# Altium schematic sheet 1_V2.schdoc
size 708 x 330 mm; Name: A_A3; Symbol: A_A3; Device: A_A3; @Project Name: samrtclick; REV: 1.0; Date: 2023-02-28; Sheet: 1/1; Draw By: kano; Company: Your Company; Convert to PCB: yes; Add into BOM: yes; @Page No: 1; @Page Count: 1; @Schematic Name: V2; @Update Date: 2023-04-04; @Page Name: V2
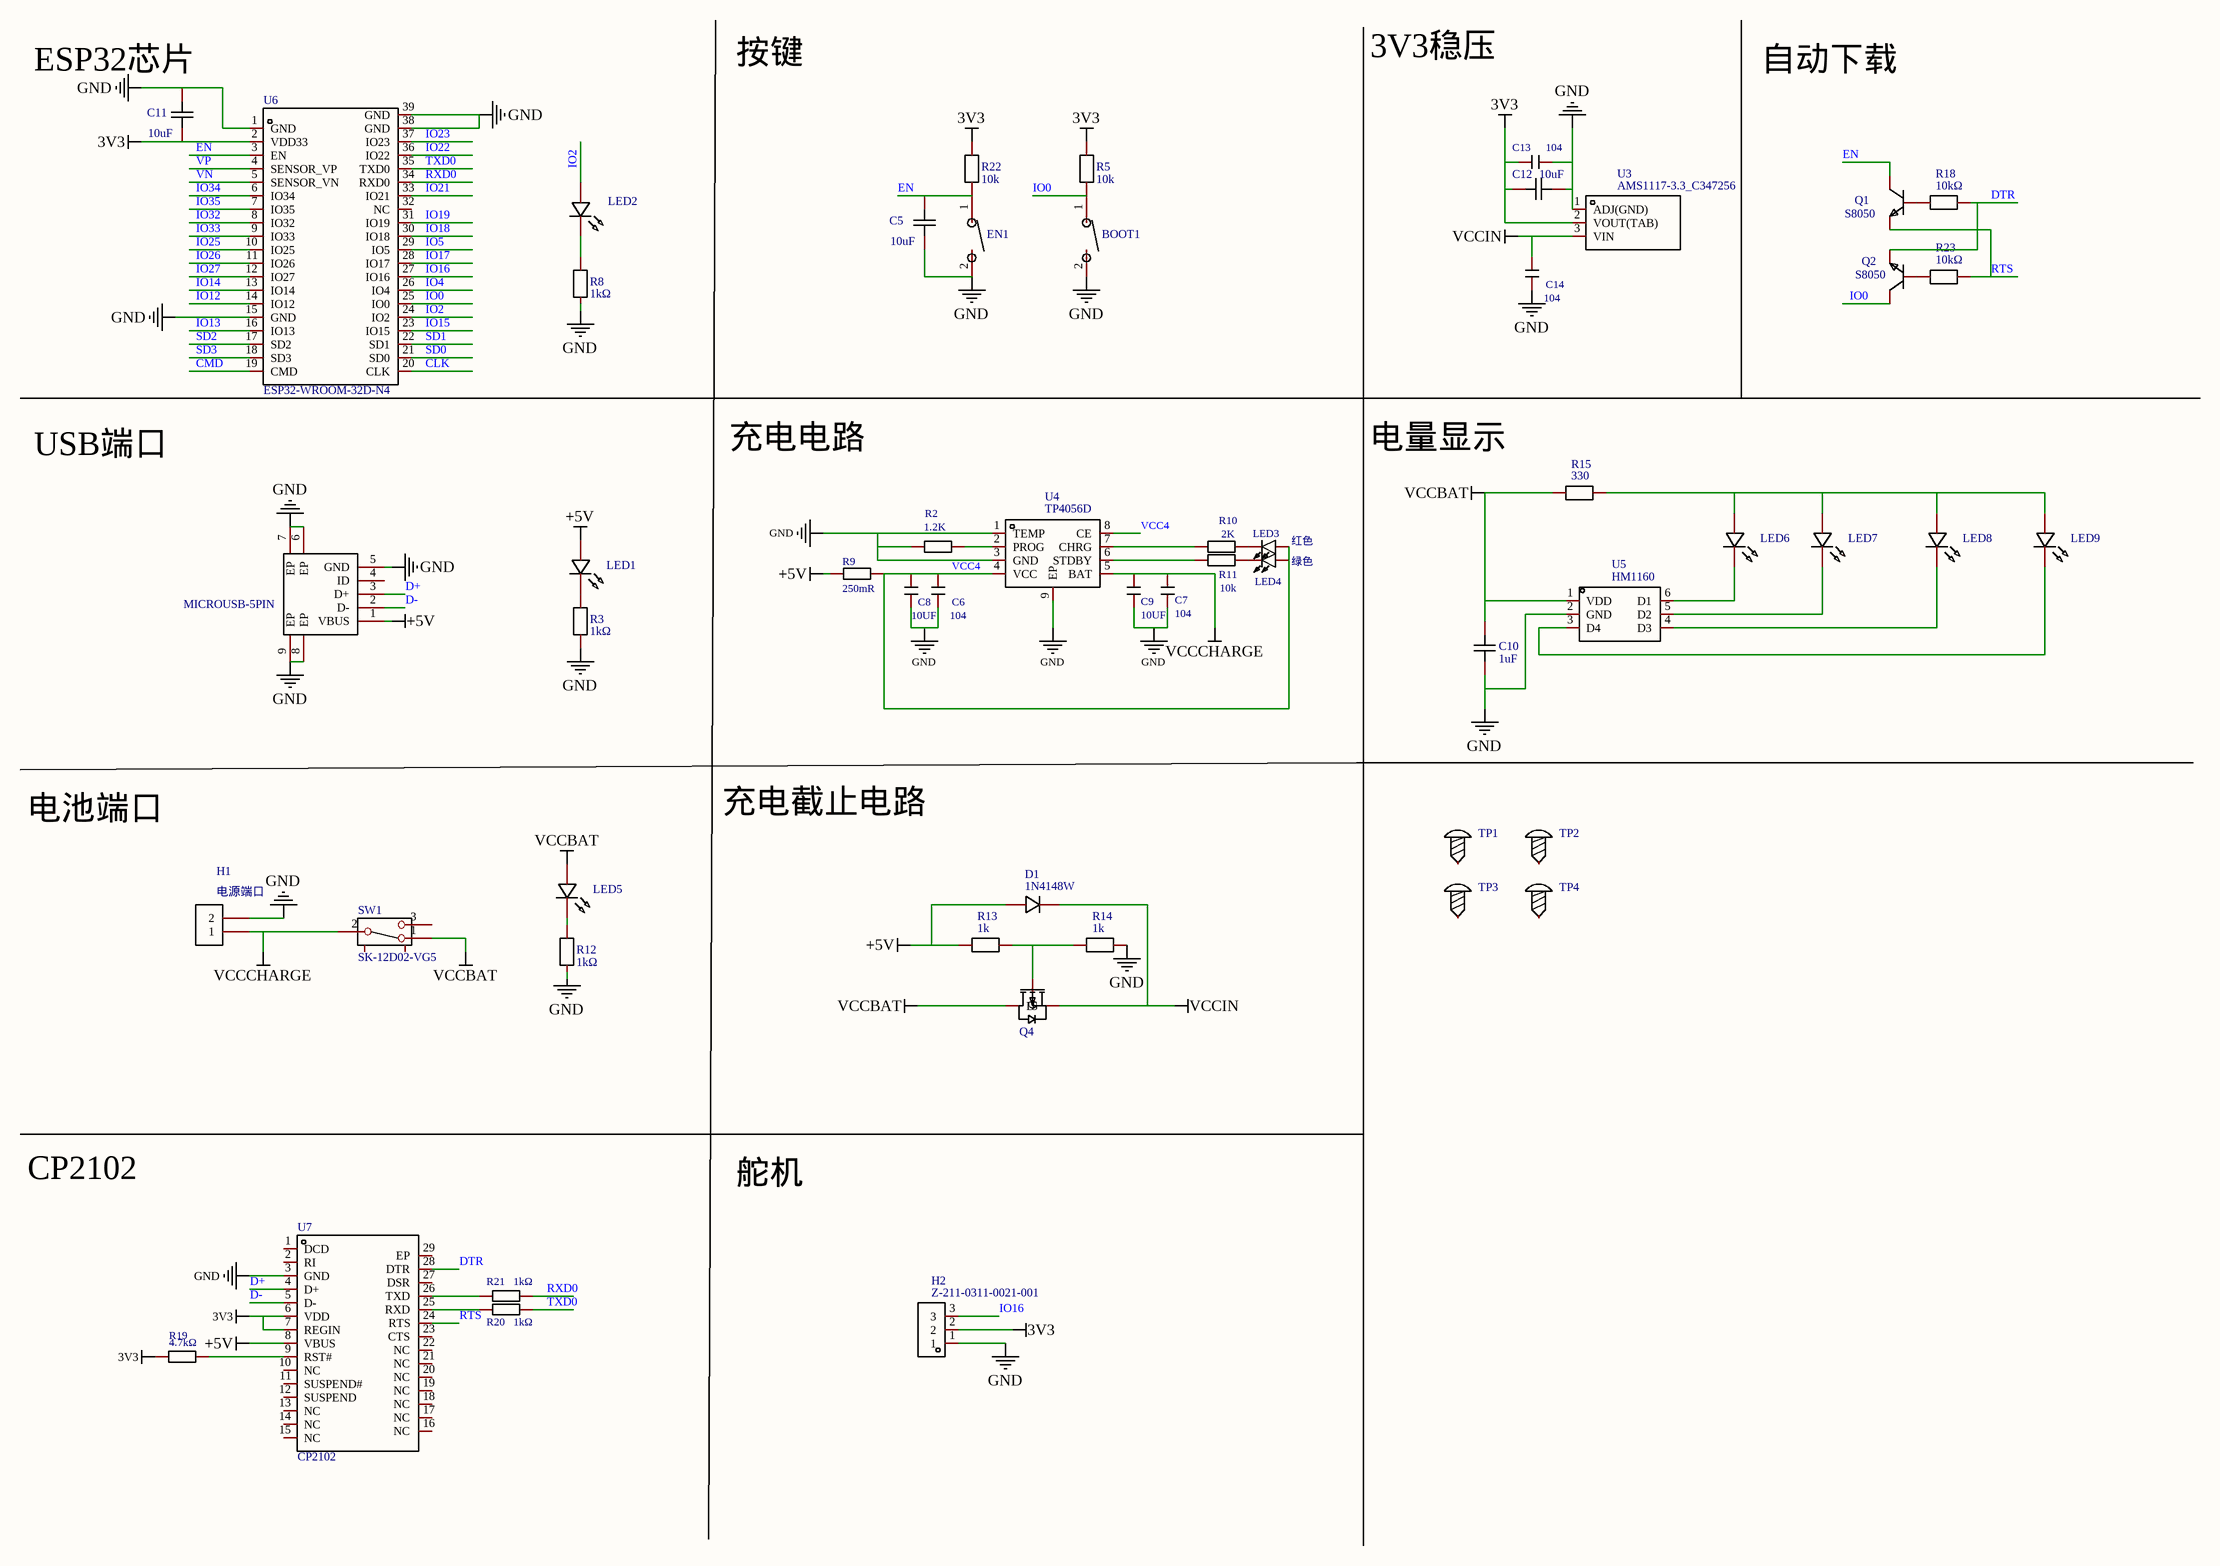
[diagram p0: 1_V2.schdoc]

## Parts
BOOT1  TSA343G00-250J2  [SW-SMD_L4.0-W2.9-LS5.0]  (value not drawn)
C5  10uF  [C0603]
C6  104  [C0603]
C7  104  [C0603]
C8  10UF  [C0805]
C9  10UF  [C0805]
C10  1uF  [C0805]
C11  10uF  [C0603]
C12  10uF  [C0805]
C13  104  [C0603]
C14  104  [C0603]
D1  1N4148W  [SOD-123FL_L2.6-W1.6-LS3.4-RD]
EN1  TSA343G00-250J2  [SW-SMD_L4.0-W2.9-LS5.0]  (value not drawn)
H1  电源端口  [HDR-TH_2P-P2.54-V-M-1]
H2  Z-211-0311-0021-001  [HDR-TH_3P-P2.54-V-M-1]
LED1  LED-0603_R  [LED0603_RED]  (value not drawn)
LED2  VLMTG1401-GS08  [LED0603-RD_GREEN]  (value not drawn)
LED3  红色  [L0603-RD]
LED4  绿色  [L0603-RD]
LED5  LED-0603_R  [LED0603_RED]  (value not drawn)
LED6  LED-0603_R  [LED0603_RED]  (value not drawn)
LED7  LED-0603_R  [LED0603_RED]  (value not drawn)
LED8  LED-0603_R  [LED0603_RED]  (value not drawn)
LED9  LED-0603_R  [LED0603_RED]  (value not drawn)
NO1  MICROUSB-5PIN  [USB-SMD_5P_MICROUSB-5PIN]
Q1  S8050  [SOT-23-3_L2.9-W1.3-P1.90-LS2.4-BR]
Q2  S8050  [SOT-23-3_L2.9-W1.3-P1.90-LS2.4-BR]
Q4  AO3401A_P  [AO3401A_SOT-23-3]  (value not drawn)
R2  1.2K  [R0603]
R3  1kΩ  [R0603]
R5  10k  [R0603]
R8  1kΩ  [R0603]
R9  250mR  [R1206_1]
R10  2K  [R0603]
R11  10k  [R0603]
R12  1kΩ  [R0603]
R13  1k  [R0603]
R14  1k  [R0603]
R15  330  [R0603]
R18  10kΩ  [R0603]
R19  4.7kΩ  [R0603]
R20  1kΩ  [R0603]
R21  1kΩ  [R0603]
R22  10k  [R0603]
R23  10kΩ  [R0603]
SW1  SK-12D02-VG5  [SW-TH_SK-12D02-VG5]
TP1  M2螺丝  [M2螺丝]  (value not drawn)
TP2  M2螺丝  [M2螺丝]  (value not drawn)
TP3  M2螺丝  [M2螺丝]  (value not drawn)
TP4  M2螺丝  [M2螺丝]  (value not drawn)
U3  AMS1117-3.3_C347256  [SOT-223-4_L6.5-W3.5-P2.30-LS7.0-BR]
U4  TP4056D  [ESOP-8_L4.9-W3.9-P1.27-LS6.0-TL-EP]
U5  HM1160  [SOT23-6]
U6  ESP32-WROOM-32D-N4  [WIFIM-SMD_39P-L25.5-W18.0-P1.27-BL]
U7  CP2102  [QFN-28_L5.0-W5.0-P0.50-TL-EP3.2]

## Nets
3V3: C11.1 C12.1 C13.2 H2.2 R5.2 R19.1 R22.2 U3.2(VOUT(TAB)) U6.2(VDD33) U7.6(VDD) U7.7(REGIN)
+5V: D1.2 LED1.1 NO1.1(VBUS) R9.1 R13.1 U7.8(VBUS)
GND: BOOT1.2 C5.1 C6.1 C7.1 C8.1 C9.1 C10.1 C11.2 C12.2 C13.1 C14.1 EN1.2 H1.2 H2.1 NO1.5(GND) NO1.6(EP) NO1.7(EP) NO1.8(EP) NO1.9(EP) R2.1 R3.2 R8.2 R12.2 R14.2 U3.1(ADJ(GND)) U4.1(TEMP) U4.3(GND) U4.9(EP) U5.2(GND) U6.1(GND) U6.15(GND) U6.38(GND) U6.39(GND) U7.3(GND)
VCCBAT: C10.2 LED5.1 Q4.3(D) R15.1 SW1.1 U5.1(VDD)
VCCCHARGE: C7.2 C9.2 H1.1 SW1.2 U4.5(BAT)
VCCIN: C14.2 D1.1 Q4.2(S) U3.3(VIN)
CLK: U6.20(CLK)
CMD: U6.19(CMD)
D+: NO1.3(D+) U7.4(D+)
D-: NO1.2(D-) U7.5(D-)
DTR: Q2.2(E) R18.2 U7.28(DTR)
EN: C5.2 EN1.1 Q1.3(C) R22.1 U6.3(EN)
IO0: BOOT1.1 Q2.3(C) R5.1 U6.25(IO0)
IO2: LED2.1 U6.24(IO2)
IO4: U6.26(IO4)
IO5: U6.29(IO5)
IO12: U6.14(IO12)
IO13: U6.16(IO13)
IO14: U6.13(IO14)
IO15: U6.23(IO15)
IO16: H2.3 U6.27(IO16)
IO17: U6.28(IO17)
IO18: U6.30(IO18)
IO19: U6.31(IO19)
IO21: U6.33(IO21)
IO22: U6.36(IO22)
IO23: U6.37(IO23)
IO25: U6.10(IO25)
IO26: U6.11(IO26)
IO27: U6.12(IO27)
IO32: U6.8(IO32)
IO33: U6.9(IO33)
IO34: U6.6(IO34)
IO35: U6.7(IO35)
RTS: Q1.2(E) R23.2 U7.24(RTS)
RXD0: R21.2 U6.34(RXD0)
SD0: U6.21(SD0)
SD1: U6.22(SD1)
SD2: U6.17(SD2)
SD3: U6.18(SD3)
TXD0: R20.2 U6.35(TXD0)
VCC4: C6.2 C8.2 LED3.1(A) LED4.1(A) R9.2 U4.4(VCC) U4.8(CE)
VN: U6.5(SENSOR_VN)
VP: U6.4(SENSOR_VP)
NetLED1_2: LED1.2 R3.1
NetLED2_2: LED2.2 R8.1
NetLED3_2: LED3.2(K) R10.2
NetLED4_2: LED4.2(K) R11.2
NetLED5_2: LED5.2 R12.1
NetLED6_1: LED6.1 LED7.1 LED8.1 LED9.1 R15.2
NetLED6_2: LED6.2 U5.6(D1)
NetLED7_2: LED7.2 U5.5(D2)
NetLED8_2: LED8.2 U5.4(D3)
NetLED9_2: LED9.2 U5.3(D4)
NetQ1_1: Q1.1(B) R18.1
NetQ2_1: Q2.1(B) R23.1
NetQ4_1: Q4.1(G) R13.2 R14.1
NetR2_2: R2.2 U4.2(PROG)
NetR10_1: R10.1 U4.7(CHRG)
NetR11_1: R11.1 U4.6(STDBY)
NetR19_2: R19.2 U7.9(RST#)
NetR20_1: R20.1 U7.25(RXD)
NetR21_1: R21.1 U7.26(TXD)

Not connected (* = marked no-connect by the designer): NO1 4(ID); SW1 3 4 5; TP1 1; TP2 1; TP3 1; TP4 1; U6 32(NC); U7 1(DCD) 2(RI) 10(NC) 11(SUSPEND#) 12(SUSPEND) 13(NC) 14(NC) 15(NC) 16(NC) 17(NC) 18(NC) 19(NC) 20(NC) 21(NC) 22(NC) 23(CTS) 27(DSR) 29(EP)

## Notes on the sheet
- 3V3稳压
- (near C11) ESP32芯片
- 按键
- 自动下载
- USB端口
- 充电电路
- 电量显示
- 电池端口
- 充电截止电路
- CP2102
- 舵机
- 1
- 2
- 3
- 4
- 5
- 6
- 7
- 8
- A
- B
- C
- D
- E
- TITLE:
- samrtclick
- REV:
- 1.0
- Date:
- Company:
- 2023-02-28
- Your Company
- Drawn By:
- kano
- Sheet:
- 1/1
- V2
- 2023-04-04

## Library data of the parts
BOOT1 EN1 = TSA343G00-250J2: 触点电流:50mA;额定电压(DC):12V;绝缘电阻:100MΩ;电路结构:单刀单掷;安装方式:立贴;按钮形状:圆形按钮;按钮/盖帽颜色:黑色;带灯:无;作用力:250gf@±50gf;机械寿命:50000;工作温度:-25℃~+70℃;引脚样式:SMD接片;开关长度:3.95mm;开关宽度:2.9mm;开关高度:2mm;带支架:否;; Manufacturer: BRIGHT(博瑞泰); Add into BOM: yes; Contact Current: 50mA; Voltage Rating (DC): 12V; Insulation Resistance: 100MΩ; Circuit: 单刀单掷; Actuator Style: 圆形按钮; Actuator/Cap Color: 黑色; With Lamp: 无; Mechanical Life: 50000; Pin Style: SMD接片; Switch Length: 3.95mm; Switch Width: 2.9mm; Switch Height: 2mm; Strike Gundam: 否; Actuator Orientation: 顶部触动; 3DModel: SW-SMD_L4.0-W2.9-H2-P4.15-EH; Paste Type: expand; Origin Footprint: SW-SMD_L4.0-W2.9-P4.15-EH; Name: TSA343G00-250J2; Symbol: TSA343G00-250J2; Device: TSA343G00-250J2; LCSC Part Name: 3*4 两脚小龟不带柱  250gf; Supplier Part: C354946; Manufacturer Part: TSA343G00-250J2; Supplier Footprint: SMD; JLCPCB Part Class: Extended Part; Datasheet: https://atta.szlcsc.com/upload/public/pdf/source/20190426/C354946_6B70DFBDFA823D17B8EB46FB9599F693.pdf; Supplier: LCSC; Convert to PCB: yes; Mounting Style: 立贴; Operating Force: 250gf@±50gf; Operating Temperature: -25℃~+70℃; Illumination Color: -; link: https://item.szlcsc.com/457634.html; Assembly Type: smtWeld
C5 C11 = 10uF: 3DModel: C0603_L1.6-W0.8-H0.8; Add into BOM: yes; Name: 10uF; Symbol: 10uF; Device: 10uF; link: https://item.szlcsc.com/362304.html; Convert to PCB: yes; Origin Footprint: C0603
C6 C7 C13 C14 = 104: 3DModel: C0603_L1.6-W0.8-H0.8; BOM名称: 无极性贴片电容; 版权归属: 源创客; Add into BOM: yes; Name: 104; Symbol: 104; Device: 104; link: https://item.szlcsc.com/362304.html; 学习资源: www.ooocke.com; Convert to PCB: yes; Origin Footprint: C0603
C8 C9 = 10UF: 3DModel: C0805_L2.0-W1.3-H1.3; BOM名称: 无极性贴片电容; 版权归属: 源创客; Add into BOM: yes; Name: 10UF; Symbol: 10UF; Device: 10UF; link: https://item.szlcsc.com/373011.html; 学习资源: www.ooocke.com; Convert to PCB: yes; Origin Footprint: C0805
C10 = 1uF: 3DModel: C0805_L2.0-W1.3-H1.3; Add into BOM: yes; Name: 1uF; Symbol: 1uF; Device: 1uF; link: https://item.szlcsc.com/373011.html; Convert to PCB: yes; Origin Footprint: C0805
C12 = 10uF: 3DModel: C0805_L2.0-W1.3-H1.3; Add into BOM: yes; Name: 10uF; Symbol: 10uF; Device: 10uF; link: https://item.szlcsc.com/373011.html; Convert to PCB: yes; Origin Footprint: C0805
D1 = 1N4148W: Manufacturer: Tak Cheong; 3DModel: SOD-123FL_L2.8-W1.8-H1.1-LS3.6; Add into BOM: yes; Name: 1N4148W; Symbol: 1N4148W; Device: 1N4148W; link: https://atta.szlcsc.com/upload/public/pdf/source/20181106/C323857_0FA3C8BFA639C8DE43C1526AE6096176.pdf; Supplier: LCSC; Manufacturer Part: 1N4148W; Supplier Part: C129216; Convert to PCB: yes; Origin Footprint: SOD-123FL_L2.6-W1.6-LS3.4-RD
H1 = 电源端口: Manufacturer: TE Connectivity(美国泰科); Manufacturer Part: 3-644456-2; 3DModel: HDR-M-2.54_1x2; Add into BOM: yes; Name: 电源端口; Symbol: 电源端口; Device: 电源端口; link: https://item.szlcsc.com/366904.html; Supplier: LCSC; Supplier Part: C90288; JLCPCB Part Class: Extended Part; Convert to PCB: yes; Origin Footprint: HDR-TH_2P-P2.54-V-M-1
H2 = Z-211-0311-0021-001: Manufacturer: Nextron(正凌); 3DModel: HDR-M-2.54_1x3; Add into BOM: yes; Name: Z-211-0311-0021-001; Symbol: Z-211-0311-0021-001; Device: Z-211-0311-0021-001; link: https://item.szlcsc.com/50265.html; Supplier: LCSC; Manufacturer Part: Z-211-0311-0021-001; Supplier Part: C152153; JLCPCB Part Class: Extended Part; Convert to PCB: yes; Origin Footprint: HDR-TH_3P-P2.54-V-M-1
LED1 LED5-LED9 = LED-0603_R: Manufacturer: EVERLIGHT(台湾亿光); Manufacturer Part: 19-217/R6C-AL1M2VY/3T; Add into BOM: yes; Name: LED-0603_R; Symbol: LED-0603_R; Device: LED-0603_R; 3DModel: LED0603_Red; Supplier Part: C72044; Supplier: LCSC; Convert to PCB: yes; Origin Footprint: LED0603_RED
LED2 = VLMTG1401-GS08: 照明颜色:-;色温 - CCT（K）:-;主波长/色坐标:-;正向电压（Vf）:-;; Manufacturer: VISHAY(威世); Add into BOM: yes; 3DModel: LED0603_Red; Name: VLMTG1401-GS08; Symbol: VLMTG1401-GS08; Device: VLMTG1401-GS08; LCSC Part Name: VLMTG1401-GS08; Supplier Part: C511604; Manufacturer Part: VLMTG1401-GS08; Supplier Footprint: 0603; JLCPCB Part Class: Extended Part; Datasheet: https://atta.szlcsc.com/upload/public/pdf/source/20200413/C511604_272E80EA2E53340B96FA7453D68B4387.pdf; Supplier: LCSC; Convert to PCB: yes; Mounting Type: -; Illumination Color: -; Lens Color: -; Correlated Color Temperature - CCT(K): -; Luminous Intensity (IF=20mA): -; Luminous Flux/Radiant Flux: -; Color Rendering Index(CRI): -; Dominant Wavelength / Coordinate rank: -; Vf - Forward Voltage: -; Size / Dimension: -; Operating Temperature: -; Height (Max): -; Origin Footprint: LED0603_RED
LED3 = 红色: BOM名称: 贴片LED; 版权归属: 源创客; Add into BOM: yes; Name: 红色; Symbol: 红色; Device: 红色; link: https://atta.szlcsc.com/upload/public/pdf/source/20180326/C98007_E988380F54303ED5DB1EDD3A08ED9857.pdf; 3DModel: L0603-RD; 学习资源: www.ooocke.com; Convert to PCB: yes; Origin Footprint: L0603-RD
LED4 = 绿色: BOM名称: 贴片LED; 版权归属: 源创客; Add into BOM: yes; Name: 绿色; Symbol: 绿色; Device: 绿色; link: https://atta.szlcsc.com/upload/public/pdf/source/20180326/C98007_E988380F54303ED5DB1EDD3A08ED9857.pdf; 3DModel: L0603-RD; 学习资源: www.ooocke.com; Convert to PCB: yes; Origin Footprint: L0603-RD
NO1 = MICROUSB-5PIN: Add into BOM: yes; Name: MICROUSB-5PIN; Symbol: MICROUSB-5PIN; Device: MICROUSB-5PIN; link: https://wenku.baidu.com/view/86fe0d6b3968011ca200912d.html; 3DModel: USB-SMD_5P_MICROUSB-5PIN; Supplier: LCSC; Supplier Part: C9900001196; Manufacturer Part: MicroUSB-5PIN; JLCPCB Part Class: Extended Part; Convert to PCB: yes; Origin Footprint: USB-SMD_5P_MICROUSB-5PIN; NO_CONNECT: yes
Q1 Q2 = S8050: Manufacturer: WPMtek(维攀微); 3DModel: SOT-23-3P_L2.9-W1.3-H1.0-LS2.4-P0.95; Add into BOM: yes; Name: S8050; Symbol: S8050; Device: S8050; link: https://www.diodes.com/assets/Package-Files/SOT23.pdf; Supplier: LCSC; Supplier Part: C2688231; Manufacturer Part: S8050; Convert to PCB: yes; Origin Footprint: SOT-23-3_L2.9-W1.3-P1.90-LS2.4-BR
Q4 = AO3401A_P: Symbol: P_MOS; Add into BOM: yes; Device: AO3401A_P; Supplier Footprint: SOT-23-3L; Convert to PCB: yes; Supplier Part: C15127
R2 = 1K: BOM名称: 贴片电阻; 版权归属: 源创客; Add into BOM: yes; Name: 1.2K; Symbol: 1K; Device: 1K; 3DModel: R0603; link: https://www.mouser.in/datasheet/2/447/PYu_RT_1_to_0_01_RoHS_L_11-1669912.pdf; 学习资源: www.ooocke.com; Convert to PCB: yes; Origin Footprint: R0603
R3 R8 R12 = ERA3VEB1001V: 温度系数:±25ppm/K;温度系数:±25ppm/K;工作温度范围:-55℃~+155℃;工作温度范围:-55℃~+155℃;精度:±0.1%;最大工作电压:100V;类型:薄膜电阻;功率:125mW;阻值:1kΩ;; Manufacturer: PANASONIC(松下); Add into BOM: yes; Tolerance: ±0.1%; Overload Voltage (Max): 100V; Power(Watts): 125mW; 3DModel: R0603_L1.6-W0.8-H0.8; Name: 1kΩ; Symbol: ERA3VEB1001V; Device: ERA3VEB1001V; LCSC Part Name: 1KΩ(1001) ±0.1%; Supplier Part: C490794; Manufacturer Part: ERA3VEB1001V; Supplier Footprint: 0603; JLCPCB Part Class: Extended Part; Datasheet: https://atta.szlcsc.com/upload/public/pdf/source/20200407/C490794_144E786BD6B5906C11E86C00580B1EF5.pdf; Supplier: LCSC; Convert to PCB: yes; Temperature Coefficient: ±25ppm/K; Operating Temperature Range: -55℃~+155℃; Type: 薄膜电阻; Value: 1kΩ; link: https://item.szlcsc.com/137208.html; Origin Footprint: R0603
R5 R22 = 10k: 3DModel: R0603_L1.6-W0.8-H0.8; Add into BOM: yes; Name: 10k; Symbol: 10k; Device: 10k; link: https://item.szlcsc.com/137208.html; Convert to PCB: yes; Origin Footprint: R0603
R9 = 250mR: BOM名称: 贴片电阻; 版权归属: 源创客; Add into BOM: yes; Name: 250mR; Symbol: 250mR; Device: 250mR; link: https://item.szlcsc.com/311874.html; 学习资源: www.ooocke.com; Convert to PCB: yes; Origin Footprint: R1206_1
R10 = 2K: BOM名称: 贴片电阻; 版权归属: 源创客; Add into BOM: yes; Name: 2K; Symbol: 2K; Device: 2K; 3DModel: R0603; link: https://www.mouser.in/datasheet/2/447/PYu_RT_1_to_0_01_RoHS_L_11-1669912.pdf; 学习资源: www.ooocke.com; Convert to PCB: yes; Origin Footprint: R0603
R11 = 10k: BOM名称: 贴片电阻; 版权归属: 源创客; Add into BOM: yes; Name: 10k; Symbol: 10k; Device: 10k; 3DModel: R0603; link: https://www.mouser.in/datasheet/2/447/PYu_RT_1_to_0_01_RoHS_L_11-1669912.pdf; 学习资源: www.ooocke.com; Convert to PCB: yes; Origin Footprint: R0603
R13 R14 = 1k: Add into BOM: yes; Name: 1k; Symbol: 1k; Device: 1k; 3DModel: R0603; link: https://www.mouser.in/datasheet/2/447/PYu_RT_1_to_0_01_RoHS_L_11-1669912.pdf; Convert to PCB: yes; Origin Footprint: R0603
R15 = 330: Add into BOM: yes; Name: 330; Symbol: 330; Device: 330; 3DModel: R0603; link: https://www.mouser.in/datasheet/2/447/PYu_RT_1_to_0_01_RoHS_L_11-1669912.pdf; Convert to PCB: yes; Origin Footprint: R0603
R18 R23 = ERJPB3B1002V: 电阻类型:厚膜电阻;阻值:10kΩ;精度:±0.1%;功率:200mW;温度系数:±50ppm/℃;最大工作电压:200V;工作温度范围:-55℃~+155℃;; Manufacturer: PANASONIC(松下); Add into BOM: yes; Tolerance: ±0.1%; Power(Watts): 200mW; Overload Voltage (Max): 200V; 3DModel: R0603_L1.6-W0.8-H0.8; Name: 10kΩ; Symbol: ERJPB3B1002V; Device: ERJPB3B1002V; LCSC Part Name: 10kΩ ±0.1% 200mW; Supplier Part: C161787; Manufacturer Part: ERJPB3B1002V; Supplier Footprint: 0603; JLCPCB Part Class: Extended Part; Datasheet: https://atta.szlcsc.com/upload/public/pdf/source/20180125/C161787_15168649453061302830.pdf; Supplier: LCSC; Convert to PCB: yes; Type: 厚膜电阻; Value: 10kΩ; Temperature Coefficient: ±50ppm/℃; Operating Temperature Range: -55℃~+155℃; link: https://item.szlcsc.com/137208.html; Origin Footprint: R0603
R19 = TNPW06034K70BEEA: 电阻类型:薄膜电阻;阻值:4.7kΩ;精度:±0.1%;功率:125mW;; Manufacturer: VISHAY(威世); Add into BOM: yes; Tolerance: ±0.1%; Power(Watts): 125mW; Temperature Coefficient: ±25ppm/℃; BOM名称: 贴片电阻; 版权归属: 源创客; Name: 4.7kΩ; Symbol: TNPW06034K70BEEA; Device: TNPW06034K70BEEA; LCSC Part Name: 4.7kΩ ±0.1% 125mW; Supplier Part: C844460; Manufacturer Part: TNPW06034K70BEEA; Supplier Footprint: 0603; JLCPCB Part Class: Extended Part; Datasheet: https://atta.szlcsc.com/upload/public/pdf/source/20221018/D2582224CA146715145C4BCCF2530B6B.pdf; Supplier: LCSC; Convert to PCB: yes; Type: 薄膜电阻; Value: 4.7kΩ; Operating Temperature Range: -55℃~+155℃; 3DModel: R0603; link: https://www.mouser.in/datasheet/2/447/PYu_RT_1_to_0_01_RoHS_L_11-1669912.pdf; Origin Footprint: R0603; 学习资源: www.ooocke.com
R20 R21 = ERA3VEB1001V: 温度系数:±25ppm/K;温度系数:±25ppm/K;工作温度范围:-55℃~+155℃;工作温度范围:-55℃~+155℃;精度:±0.1%;最大工作电压:100V;类型:薄膜电阻;功率:125mW;阻值:1kΩ;; Manufacturer: PANASONIC(松下); Add into BOM: yes; Tolerance: ±0.1%; Overload Voltage (Max): 100V; Power(Watts): 125mW; BOM名称: 贴片电阻; 版权归属: 源创客; Name: 1kΩ; Symbol: ERA3VEB1001V; Device: ERA3VEB1001V; LCSC Part Name: 1KΩ(1001) ±0.1%; Supplier Part: C490794; Manufacturer Part: ERA3VEB1001V; Supplier Footprint: 0603; JLCPCB Part Class: Extended Part; Datasheet: https://atta.szlcsc.com/upload/public/pdf/source/20200407/C490794_144E786BD6B5906C11E86C00580B1EF5.pdf; Supplier: LCSC; Convert to PCB: yes; Temperature Coefficient: ±25ppm/K; Operating Temperature Range: -55℃~+155℃; Type: 薄膜电阻; Value: 1kΩ; 3DModel: R0603; link: https://www.mouser.in/datasheet/2/447/PYu_RT_1_to_0_01_RoHS_L_11-1669912.pdf; Origin Footprint: R0603; 学习资源: www.ooocke.com
SW1 = SK-12D02-VG5_C136722: 额定电流(DC):-;额定电压(DC):-;额定电流(AC):-;额定电压(AC):-;电路结构:单刀双掷;安装方式:卧插;机械寿命:5000;滑钮形状:矩形柱状;引脚样式:PC引脚;工作温度:-25℃~+70℃;开关高度:9.5mm;; Manufacturer: 韩国韩荣; Add into BOM: yes; Circuit: 单刀双掷; Mechanical Life: 5000; Actuator Style: 矩形柱状; Pin Style: PC引脚; Switch Height: 9.5mm; Name: SK-12D02-VG5; Symbol: SK-12D02-VG5; Device: SK-12D02-VG5_C136722; LCSC Part Name: SK-12D02-VG5; Supplier Part: C136722; Manufacturer Part: SK-12D02-VG5; Supplier Footprint: 插件; JLCPCB Part Class: Extended Part; Datasheet: https://atta.szlcsc.com/upload/public/pdf/source/20180731/C136723_39114FC09BF2E9DC98823B78B7234B45.pdf; Supplier: LCSC; Convert to PCB: yes; Current Rating (DC): -; Voltage Rating (DC): -; Current Rating (AC): -; Voltage Rating (AC): -; Mounting Style: 卧插; Operating Temperature: -25℃~+70℃; NO_CONNECT: yes
TP1-TP4 = M2螺丝: Symbol: 螺丝孔; Convert to PCB: yes; Device: M2螺丝; Add into BOM: yes; Supplier Footprint: 插件
U3 = AMS1117-3.3_C347256: Manufacturer: Youtai Semiconductor Co., Ltd.; 3DModel: SOT-223-4P_L6.5-W3.5-H1.6-LS7.0-P2.30; Paste Type: expand; Add into BOM: yes; Name: AMS1117-3.3_C347256; Symbol: AMS1117-3.3_C347256; Device: AMS1117-3.3_C347256; link: https://item.szlcsc.com/84517.html; Supplier: LCSC; Supplier Part: C347256; Manufacturer Part: AMS1117-3.3; Assembly Type: smtWeld; Convert to PCB: yes; Origin Footprint: SOT-223-4_L6.5-W3.5-P2.30-LS7.0-BR
U4 = TP4056D: Manufacturer: 拓微集成; 3DModel: ESOP-8_L4.9-W3.9-H1.6-LS6.0-P1.27; Add into BOM: yes; Name: TP4056D; Symbol: TP4056D; Device: TP4056D; link: https://img.jlc.com/pdf/applyPasteComponent/2022-01-14/296412A/fe074eb14c014e62a4772fc0c12ab405/TP4056D.pdf; Supplier: LCSC; Supplier Part: C9900006240; Manufacturer Part: TP4056D; JLCPCB Part Class: Extended Part; Convert to PCB: yes; Origin Footprint: ESOP-8_L4.9-W3.9-P1.27-LS6.0-TL-EP
U5 = HM1160: Manufacturer: Shenzhen Chip Hope Micro-Electronics; Manufacturer Part: LP3772-1; Add into BOM: yes; Name: HM1160; Symbol: HM1160; Device: HM1160; Supplier: LCSC; Supplier Part: C360132; Convert to PCB: yes; Origin Footprint: SOT23-6
U6 = ESP32-WROOM-32D-N4_C473012: ESP32-WROOM-32D 集成 ESP32-D0WD，功能强大，用途广泛，可以用于低功耗传感器网络和要求极高的任务，例如语音编码、音频流和 MP3 解码等。; Manufacturer: ESPRESSIF(乐鑫); Add into BOM: yes; Name: ESP32-WROOM-32D-N4; Symbol: ESP32-WROOM-32D; Device: ESP32-WROOM-32D-N4_C473012; LCSC Part Name: ESP32-WROOM-32D-N4; Supplier Part: C473012; Manufacturer Part: ESP32-WROOM-32D-N4; Supplier Footprint: SMD,18x25.5mm; JLCPCB Part Class: Extended Part; Datasheet: https://atta.szlcsc.com/upload/public/pdf/source/20191225/C473012_1E74417EE995DBCF17C94BD318A37DAB.pdf; Supplier: LCSC; Convert to PCB: yes; NO_CONNECT: yes
U7 = CP2102: Add into BOM: yes; Name: CP2102; Symbol: CP2102; Device: CP2102; LCSC Part Name: CP2102; Supplier Part: C9900004371; Manufacturer Part: CP2102; Supplier Footprint: QFN-28_L5.0-W5.0-P0.50-EP3.2; JLCPCB Part Class: Extended Part; Supplier: LCSC; Convert to PCB: yes; NO_CONNECT: yes